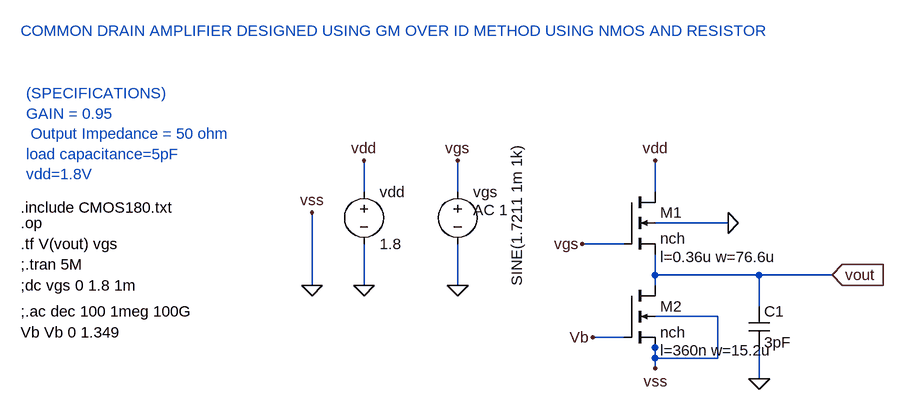
[diagram p0: schematic Assignment_CDAmp.asc]
Assignment_CDAmp.asc, the LTspice schematic file:
Version 4
SHEET 1 880 680
WIRE -128 128 -128 80
WIRE 16 128 16 80
WIRE 320 128 320 80
WIRE 432 176 320 176
WIRE 272 208 208 208
WIRE 320 256 320 224
WIRE 480 256 320 256
WIRE 592 256 480 256
WIRE -208 272 -208 160
WIRE -128 272 -128 208
WIRE 16 272 16 208
WIRE 320 272 320 256
WIRE 480 304 480 256
WIRE 416 320 320 320
WIRE 272 352 224 352
WIRE 320 368 320 352
WIRE 320 384 320 368
WIRE 416 384 416 320
WIRE 416 384 320 384
WIRE 320 400 320 384
WIRE 480 416 480 368
FLAG 16 272 0
FLAG -128 272 0
FLAG -208 272 0
FLAG -128 80 vdd
FLAG 16 80 vgs
FLAG 320 400 vss
FLAG 208 208 vgs
FLAG 320 80 vdd
FLAG 592 256 vout
IOPIN 592 256 In
FLAG 480 416 0
FLAG -208 160 vss
FLAG 432 176 0
FLAG 224 352 Vb
SYMBOL nmos4 272 128 R0
WINDOW 123 56 100 Left 2
SYMATTR Value2 l=0.36u w=76.6u
SYMATTR InstName M1
SYMATTR Value nch
SYMBOL voltage -128 112 R0
WINDOW 123 0 0 Left 0
WINDOW 39 0 0 Left 0
SYMATTR InstName vdd
SYMATTR Value 1.8
SYMBOL voltage 16 112 R0
WINDOW 123 24 44 Left 2
WINDOW 39 0 0 Left 0
WINDOW 3 91 -58 VRight 2
SYMATTR Value2 AC 1
SYMATTR Value SINE(1.7211 1m 1k)
SYMATTR InstName vgs
SYMBOL cap 464 304 R0
SYMATTR InstName C1
SYMATTR Value 3pF
SYMBOL nmos4 272 272 R0
WINDOW 123 56 100 Left 2
SYMATTR InstName M2
SYMATTR Value nch
SYMATTR Value2 l=360n w=15.2u
TEXT -656 152 Left 2 !.include CMOS180.txt
TEXT -656 176 Left 2 !.op
TEXT -656 208 Left 2 !.tf V(vout) vgs
TEXT -656 240 Left 2 !;.tran 5M
TEXT -656 272 Left 2 !;dc vgs 0 1.8 1m
TEXT -648 -24 Left 2 ;(SPECIFICATIONS)\nGAIN = 0.95\n Output Impedance = 50 ohm\nload capacitance=5pF\nvdd=1.8V
TEXT -656 -120 Left 2 ;COMMON DRAIN AMPLIFIER DESIGNED USING GM OVER ID METHOD USING NMOS AND RESISTOR
TEXT -656 312 Left 2 !;.ac dec 100 1meg 100G
TEXT -656 344 Left 2 !Vb Vb 0 1.349

The netlist it stands for:
* Assignment_CDAmp.asc
M1 vdd vgs vout 0 nch l=0.36u w=76.6u
vdd vdd 0 1.8
vgs vgs 0 SINE(1.7211 1m 1k) AC 1
C1 vout 0 3pF
M2 vout Vb 0 0 nch l=360n w=15.2u
.model NMOS NMOS
.model PMOS PMOS
.lib standard.mos
.include CMOS180.txt
.op
.tf V(vout) vgs
;.tran 5M
;dc vgs 0 1.8 1m
* (SPECIFICATIONS)
* GAIN = 0.95
*  Output Impedance = 50 ohm
* load capacitance=5pF
* vdd=1.8V
* COMMON DRAIN AMPLIFIER DESIGNED USING GM OVER ID METHOD USING NMOS AND RESISTOR
;.ac dec 100 1meg 100G
Vb Vb 0 1.349
.backanno
.end